# EAGLE design av_unit_fan_ctrl (EAGLE 6.4)
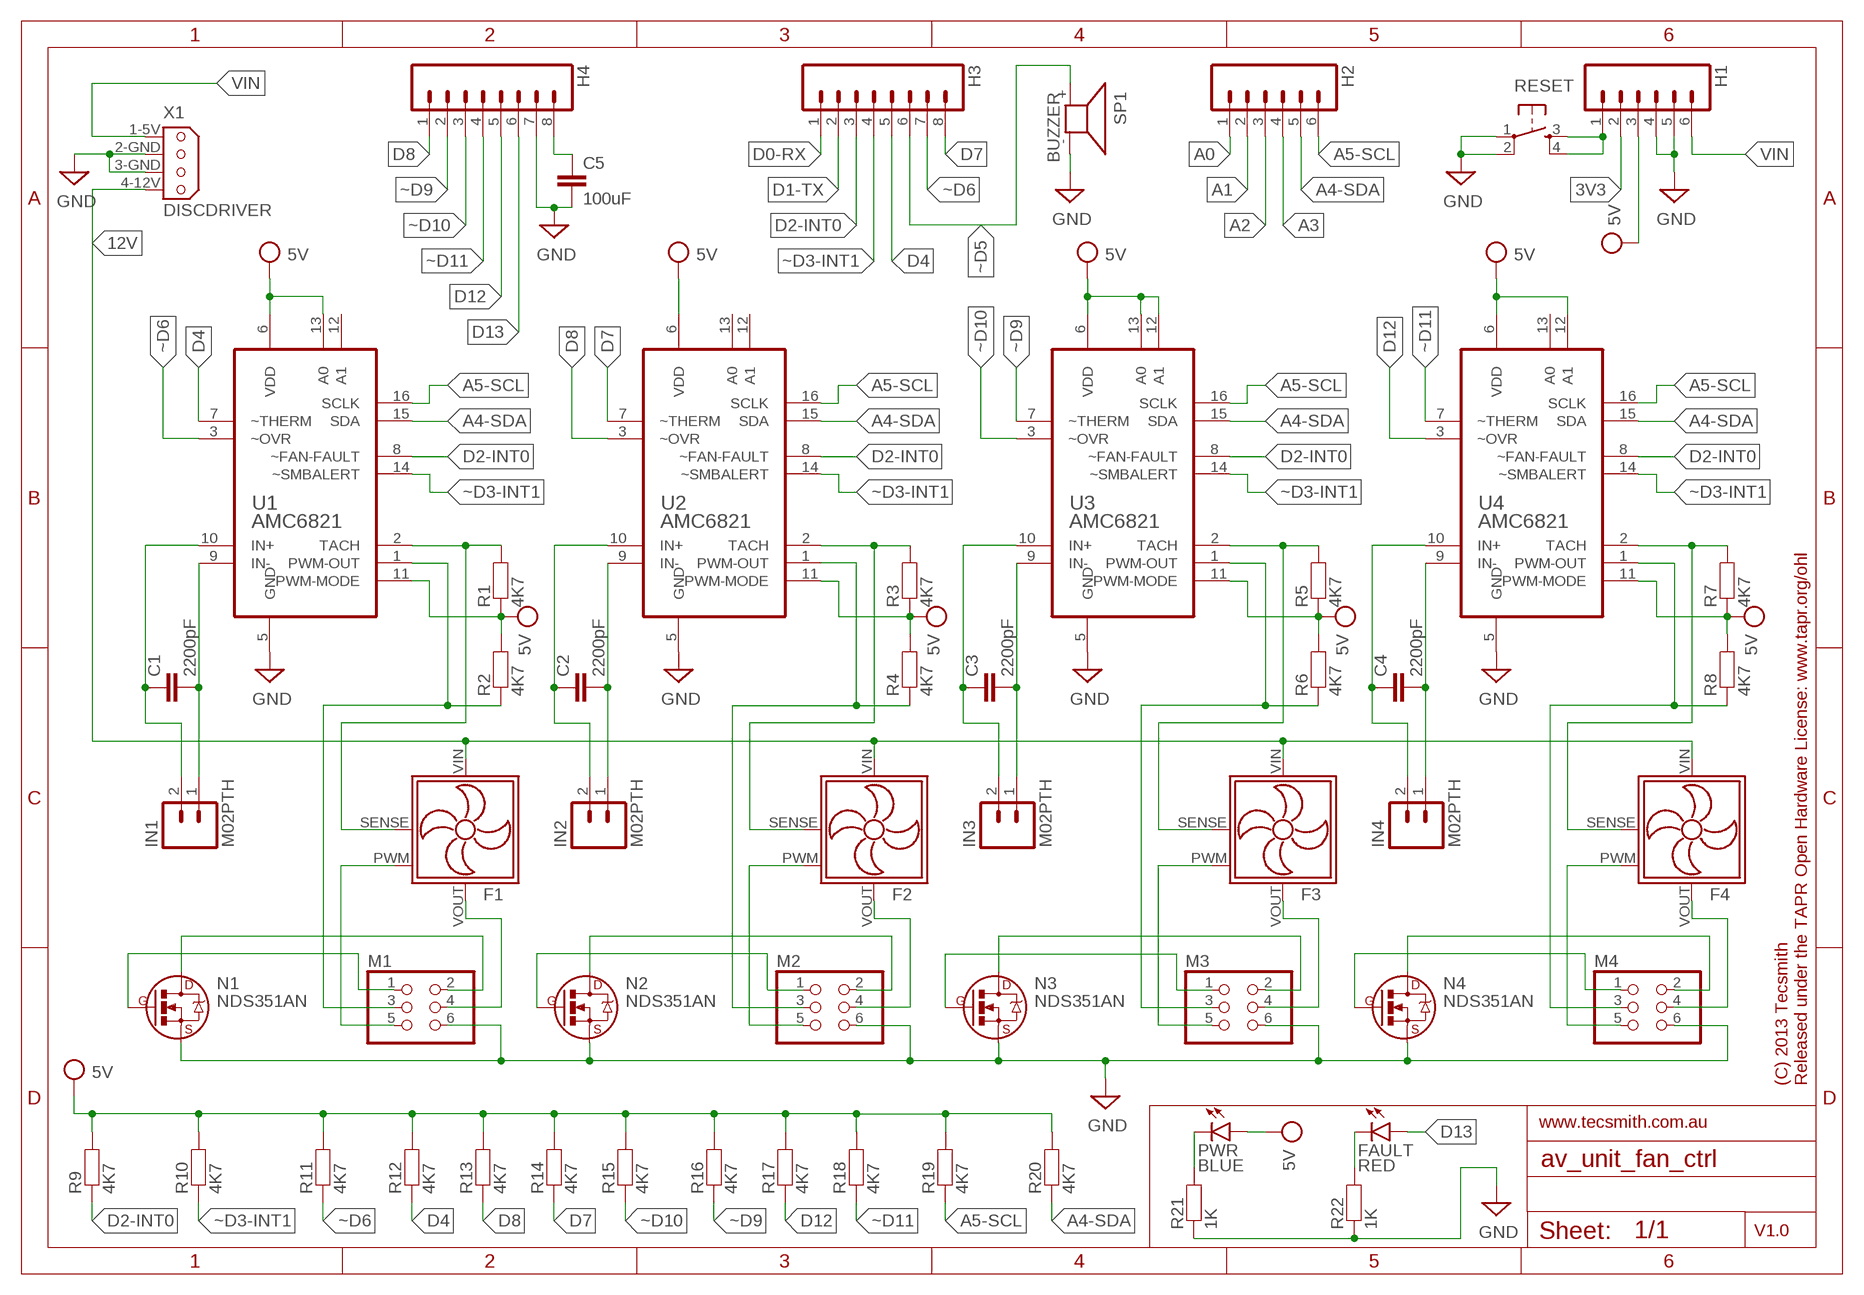
[diagram p0: schematic, sheet 1]

## Parts
C1  2200pF  CAP0603  [0603]
C2  2200pF  CAP0603  [0603]
C3  2200pF  CAP0603  [0603]
C4  2200pF  CAP0603  [0603]
C5  100uF  CAP0603  [0603]
F1  FAN_4-WIREINTEL  [47053-1000]
F2  FAN_4-WIREINTEL  [47053-1000]
F3  FAN_4-WIREINTEL  [47053-1000]
F4  FAN_4-WIREINTEL  [47053-1000]
FAULT  RED  LED0603  [LED-0603]
H1  M06SIP  [1X06]
H2  M06SIP  [1X06]
H3  M08  [1X08]
H4  M08  [1X08]
IN1  M02PTH  [1X02]
IN2  M02PTH  [1X02]
IN3  M02PTH  [1X02]
IN4  M02PTH  [1X02]
M1  PINHD-2X3  [2X03]
M2  PINHD-2X3  [2X03]
M3  PINHD-2X3  [2X03]
M4  PINHD-2X3  [2X03]
N1  NDS351AN  NMOSFETGSD  [SOT23]
N2  NDS351AN  NMOSFETGSD  [SOT23]
N3  NDS351AN  NMOSFETGSD  [SOT23]
N4  NDS351AN  NMOSFETGSD  [SOT23]
PWR  BLUE  LED0603  [LED-0603]
R1  4K7  RESISTOR0603  [0603]
R2  4K7  RESISTOR0603  [0603]
R3  4K7  RESISTOR0603  [0603]
R4  4K7  RESISTOR0603  [0603]
R5  4K7  RESISTOR0603  [0603]
R6  4K7  RESISTOR0603  [0603]
R7  4K7  RESISTOR0603  [0603]
R8  4K7  RESISTOR0603  [0603]
R9  4K7  RESISTOR0603  [0603]
R10  4K7  RESISTOR0603  [0603]
R11  4K7  RESISTOR0603  [0603]
R12  4K7  RESISTOR0603  [0603]
R13  4K7  RESISTOR0603  [0603]
R14  4K7  RESISTOR0603  [0603]
R15  4K7  RESISTOR0603  [0603]
R16  4K7  RESISTOR0603  [0603]
R17  4K7  RESISTOR0603  [0603]
R18  4K7  RESISTOR0603  [0603]
R19  4K7  RESISTOR0603  [0603]
R20  4K7  RESISTOR0603  [0603]
R21  1K  RESISTOR0603  [0603]
R22  1K  RESISTOR0603  [0603]
RESET  TAC_SWITCHPTH  [TACTILE-PTH]
SP1  BUZZER  [KSTG951AP]
U1  AMC6821  AMC6821SDBQQSOP  [QSOP-16N]
U2  AMC6821  AMC6821SDBQQSOP  [QSOP-16N]
U3  AMC6821  AMC6821SDBQQSOP  [QSOP-16N]
U4  AMC6821  AMC6821SDBQQSOP  [QSOP-16N]
X1  DISCDRIVER  [9090-4R]

## Nets
3V3: H1.2
5V: H1.3 PWR.A R1.1 R2.2 R3.1 R4.2 R5.1 R6.2 R7.1 R8.2 R9.2 R10.2 R11.2 R12.2 R13.2 R14.2 R15.2 R16.2 R17.2 R18.2 R19.2 R20.2 U1.6(VDD) U1.11(PWM-MODE) U1.13(A0) U2.6(VDD) U2.11(PWM-MODE) U3.6(VDD) U3.11(PWM-MODE) U3.12(A1) U3.13(A0) U4.6(VDD) U4.11(PWM-MODE) U4.12(A1)
12V: F1.VIN(PWR) F2.VIN(PWR) F3.VIN(PWR) F4.VIN(PWR) X1.4-12V
A0: H2.1
A1: H2.2
A2: H2.3
A3: H2.4
A4-SDA: H2.5 R20.1 U1.15(SDA) U2.15(SDA) U3.15(SDA)
A5-SCL: H2.6 R19.1 U1.16(SCLK) U2.16(SCLK) U3.16(SCLK) U4.16(SCLK)
AREF: C5.1 H4.8
D0-RX: H3.1
D1-TX: H3.2
D2-INT0: H3.3 R9.1 U1.8(~FAN-FAULT) U2.8(~FAN-FAULT) U3.8(~FAN-FAULT) U4.8(~FAN-FAULT)
D4: H3.5 R12.1 U1.7(~THERM)
D7: H3.8 R14.1 U2.7(~THERM)
D8: H4.1 R13.1 U2.3(~OVR)
D12: H4.5 R17.1 U4.3(~OVR)
D13: FAULT.A H4.6
GND: C5.2 H1.4 H1.5 H4.7 M1.6 M2.6 M3.6 M4.6 N1.2(S) N2.2(S) N3.2(S) N4.2(S) R21.1 R22.1 RESET.1 RESET.2 SP1.- U1.5(GND) U2.5(GND) U3.5(GND) U4.5(GND) X1.2-GND X1.3-GND
N$1: F1.VOUT(GND) M1.4
N$2: F2.VOUT(GND) M2.4
N$3: F1.PWM M1.5
N$4: F4.VOUT(GND) M4.4
N$5: M1.2 N1.3(D)
N$6: M2.2 N2.3(D)
N$7: M3.2 N3.3(D)
N$8: M4.2 N4.3(D)
N$11: FAULT.C R22.2
N$12: PWR.C R21.2
N$13: M1.1 N1.1(G)
N$14: M4.3 R8.1 U4.1(PWM-OUT)
N$15: M3.1 N3.1(G)
N$17: F4.SENSE R7.2 U4.2(TACH)
N$21: M3.3 R6.1 U3.1(PWM-OUT)
N$22: F3.SENSE R5.2 U3.2(TACH)
N$23: C1.1 IN1.2 U1.10(IN+)
N$24: M2.3 R4.1 U2.1(PWM-OUT)
N$25: F2.SENSE R3.2 U2.2(TACH)
N$26: M2.1 N2.1(G)
N$27: H1.1 RESET.3 RESET.4
N$28: F4.PWM M4.5
N$29: F3.PWM M3.5
N$30: M4.1 N4.1(G)
N$31: M1.3 R2.1 U1.1(PWM-OUT)
N$33: F1.SENSE R1.2 U1.2(TACH)
N$34: F3.VOUT(GND) M3.4
N$35: F2.PWM M2.5
N$45: C4.1 IN4.2 U4.10(IN+)
N$54: C3.1 IN3.2 U3.10(IN+)
N$56: C2.1 IN2.2 U2.10(IN+)
N$57: C1.2 IN1.1 U1.9(IN-)
N$58: C2.2 IN2.1 U2.9(IN-)
N$59: C3.2 IN3.1 U3.9(IN-)
N$60: C4.2 IN4.1 U4.9(IN-)
VIN: H1.6 X1.1-5V
~D3-INT1: H3.4 R10.1 U1.14(~SMBALERT) U2.14(~SMBALERT) U3.14(~SMBALERT) U4.14(~SMBALERT)
~D5: H3.6 SP1.+
~D6: H3.7 R11.1 U1.3(~OVR)
~D9: H4.2 R16.1 U3.7(~THERM)
~D10: H4.3 R15.1 U3.3(~OVR)
~D11: H4.4 R18.1 U4.7(~THERM)
Unconnected: U1.12(A1) U2.12(A1) U2.13(A0) U4.13(A0) U4.15(SDA)

## Notes on the sheet
- (C) 2013 Tecsmith | Released under the TAPR Open Hardware License: www.tapr.org/ohl
- www.tecsmith.com.au
- V1.0

## Library data of the parts
C1-C5 = arduino:CAP: Capacitor Standard 0603 ceramic capacitor, and 0.1" leaded capacitor.
F1-F4 = fans:FAN_4-WIRE: INTEL SPEC HEADER Source: http://www.molex.com/pdm_docs/sd/026604100_sd.pdf
FAULT PWR = arduino:LED: LEDs Standard schematic elements and footprints for 5mm, 3mm, 1206, and 0603 sized LEDs. 5mm - Spark Fun Electronics SKU : COM-00529 (and others)
H1 H2 = arduino:M06: Header 6 Standard 6-pin 0.1" header. Use with straight break away headers (SKU : PRT-00116), right angle break away headers (PRT-00553), swiss pins (PRT-00743), machine pins (PRT-00117), and female headers (PRT-00115). Molex polarized connector foot print use with SKU : PRT-08094 with associated crimp pins and housings. NOTES ON THE VARIANTS LOCK and LOCK_LONGPADS... This footprint was designed to help hold the alignment of a through-hole component (i.e. 6-pin header) while soldering it into place. You may notice that each hole has been shifted either up or down by 0.005 of an inch from it's more standard position (which is a perfectly straight line). This slight alteration caused the pins (the squares in the middle) to touch the edges of the holes. Because they are alternating, it causes a "brace" to hold the component in place. 0.005 has proven to be the perfect amount of "off-center" position when using our standard breakaway headers. Although looks a little odd when you look at the bare footprint, once you have a header in there, the alteration is very hard to notice. Also, if you push a header all the way into place, it is covered up entirely on the bottom side. This idea of altering the position of holes to aid alignment will be further integrated into the Sparkfun Library for other footprints. It can help hold any component with 3 or more connection pins.
H3 H4 = arduino:M08: Header 8 Standard 8-pin 0.1" header. Use with straight break away headers (SKU : PRT-00116), right angle break away headers (PRT-00553), swiss pins (PRT-00743), machine pins (PRT-00117), and female headers (PRT-00115).
IN1-IN4 = arduino:M02: Header 2
M1-M4 = arduino:PINHD-2X3: PIN HEADER
N1-N4 = arduino:NMOSFET: N-Channel MOSFET
R1-R22 = arduino:RESISTOR: Resistor Basic schematic elements and footprints for 0603, 1206, and PTH 1/10th watt (small) resistors.
RESET = arduino:TAC_SWITCH: Momentary Switch Button commonly used for reset or general input. Spark Fun Electronics SKU : COM-00097
SP1 = arduino:BUZZER: SPEAKER Source: Schukat; OC_FARNELL: unknown; OC_NEWARK: unknown
U1-U4 = ti-fans:AMC6821SDBQ: Intelligent Temperature Monitor and PWM Fan Controller; MPN: AMC6821SDBQ; OC_FARNELL: 1754744; OC_NEWARK: 52M3024; PACKAGE: QSOP-16; SUPPLIER: TEXAS INSTRUMENTS
X1 = fans:DISCDRIVE: Disk Drive Power four position Source: Thomas & Betts Electronic Interconnects Eiropean Edition 1998; OC_FARNELL: unknown; OC_NEWARK: unknown

## Net classes
2 gnd: width 0.254 mm, drill 0.61 mm, clearance 0.254 mm

## Board
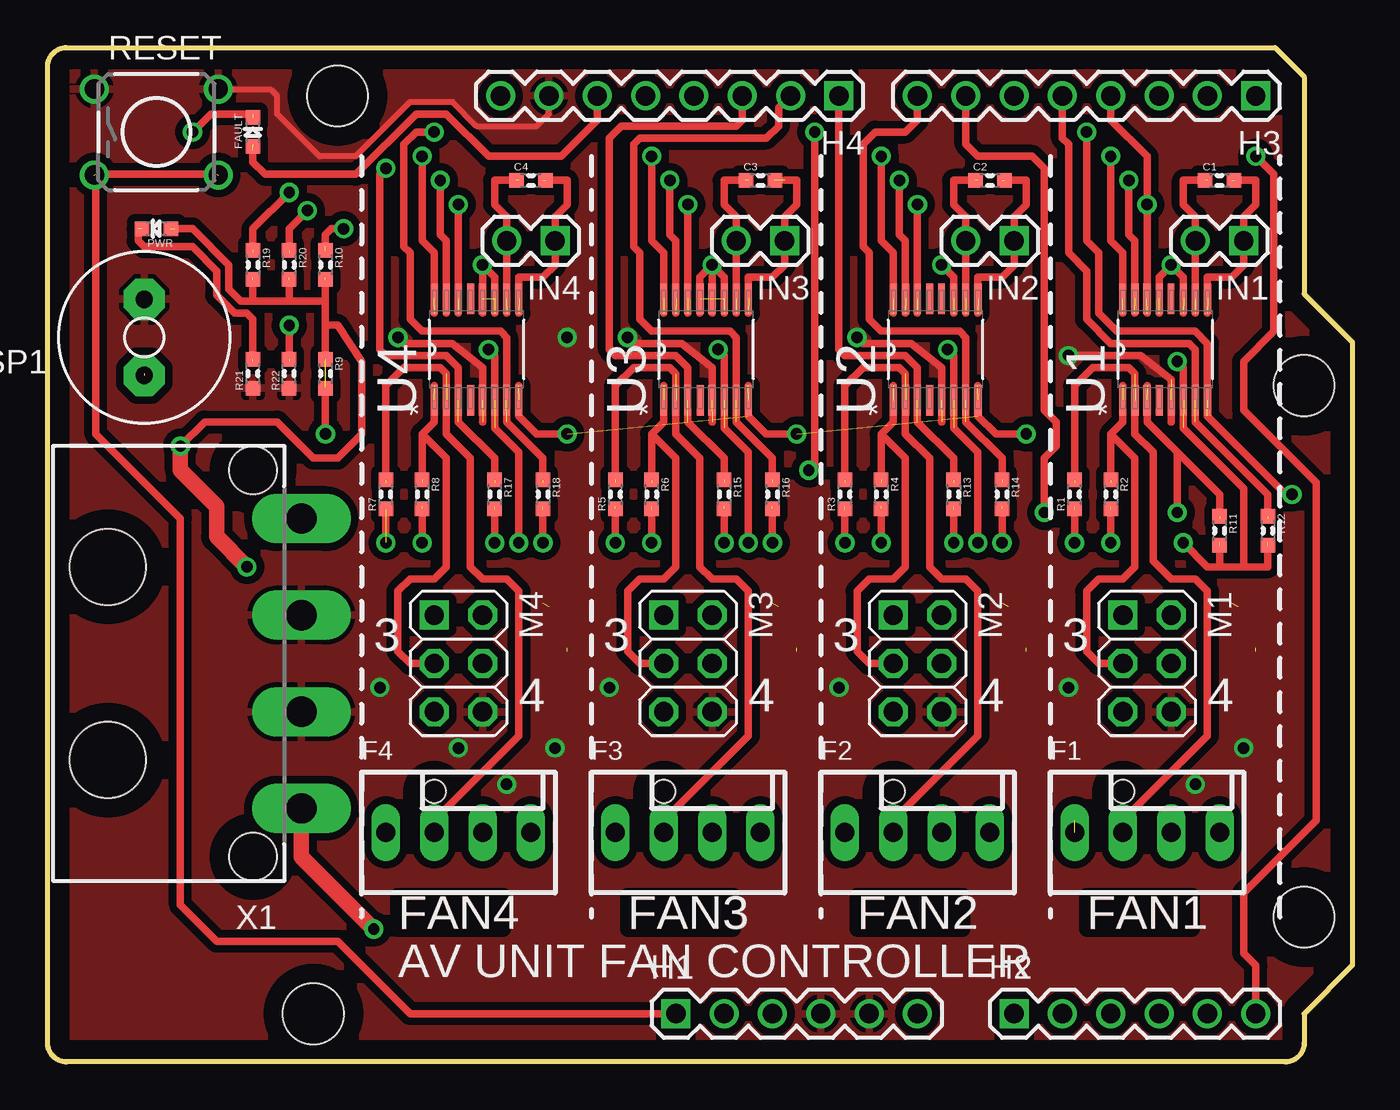
[diagram p1: board, top side]
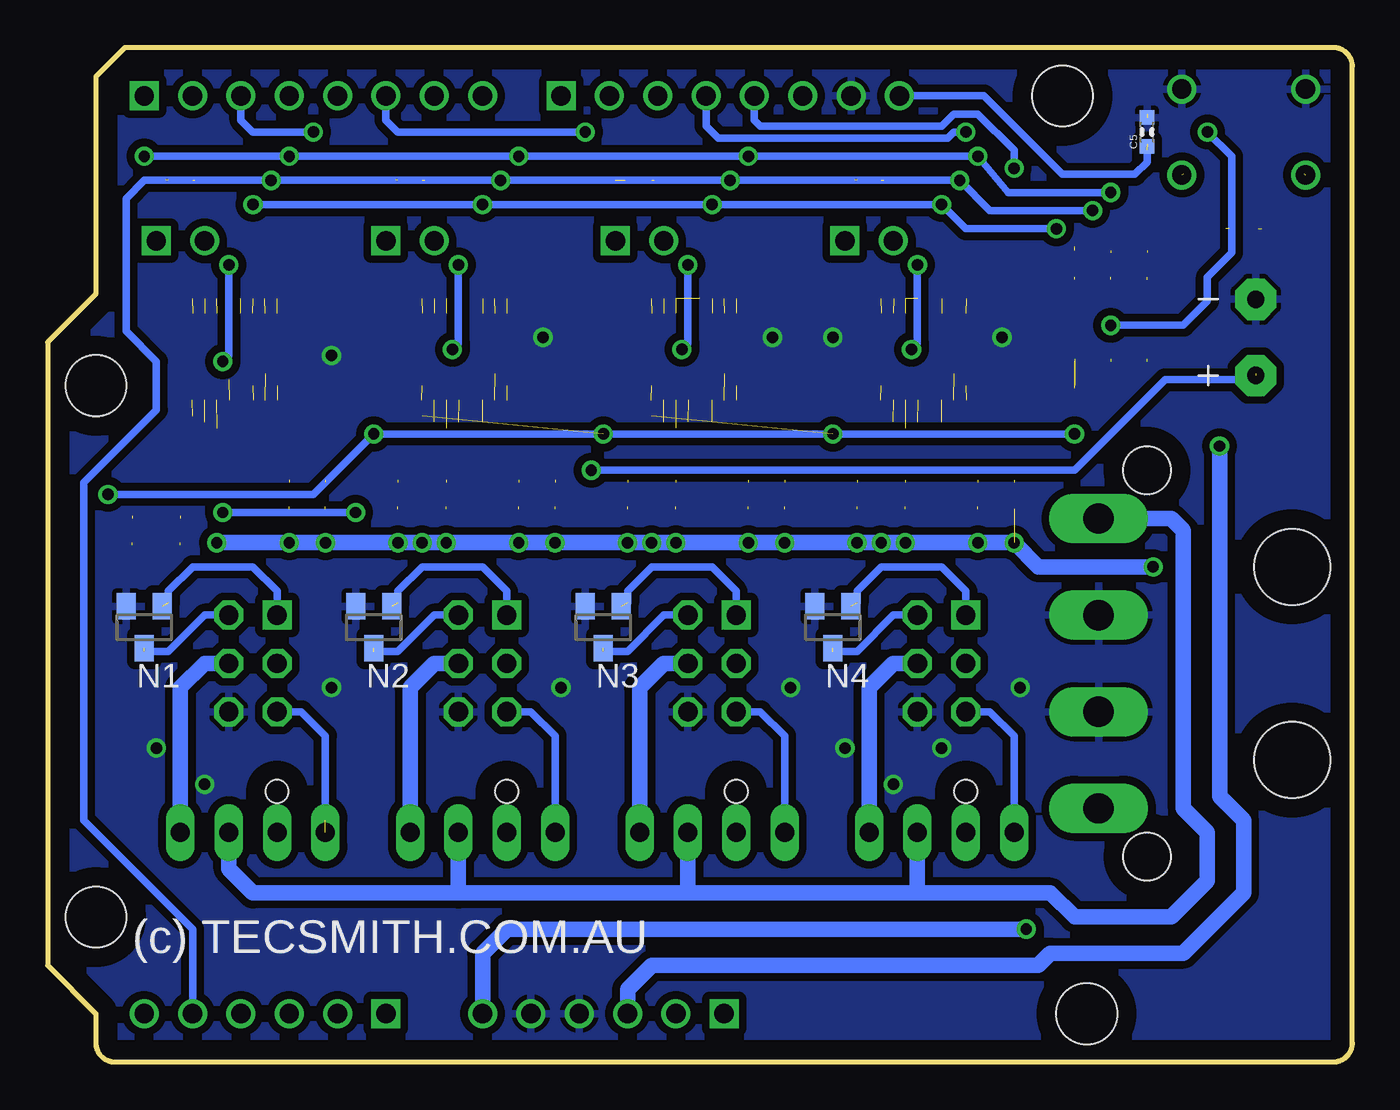
[diagram p2: board, bottom side, seen from below]

Size 68.58 x 53.34 mm. Coordinates in mm from the lower left corner, seen from the top.
Outline: 64.52,53.34 66.04,51.82 66.04,40.39 68.58,37.85 68.58,5.08 66.04,2.54 66.04,1 arc-90 65.04,0 1,0 arc-90 0,1 0,52.34 arc-90 1,53.34 64.52,53.34
Copper layers (1*16): Top 0.035mm / dielectric 1.5mm / Bottom 0.035mm
Design rules "default": minimum track width 10mil, minimum drill 24mil, track to track 8mil, track to pad 8mil, pad to pad 8mil, via to via 8mil, smd to smd 8mil, copper to edge 40mil, drill to drill 8mil, minimum pad ring 10mil, minimum via ring 8mil, stop-mask expansion 4mil, vias tented up to drill 0mil, thermal gap 10mil
Holes 3.2 mm at 66.04,35.56 66.04,7.62 15.24,50.8 13.97,2.54

### Footprints (pad centres in the part's own frame; a part is rotated, then mirrored left to right if it is on the bottom)
0603 = smd 0.762 x 0.762: 1 -0.762,0; 2 0.762,0
47053-1000 = drill 1 long: PWM -3.81,0; SENSE -1.27,0; VIN 1.27,0; VOUT 3.81,0 | hole 1.2: -1.27,2.159
LED-0603 = smd 0.762 x 0.762: A -0.762,0; C 0.762,0
1X06 = drill 1.016 square: 1 0,0 | drill 1.016: 2 2.54,0; 3 5.08,0; 4 7.62,0; 5 10.16,0; 6 12.7,0
1X08 = drill 1.016 square: 1 0,0 | drill 1.016: 2 2.54,0; 3 5.08,0; 4 7.62,0; 5 10.16,0; 6 12.7,0; 7 15.24,0; 8 17.78,0
1X02 = drill 1.016 square: 1 0,0 | drill 1.016: 2 2.54,0
2X03 = drill 1.016 square: 1 -2.54,-1.27 | drill 1.016 octagon: 2 -2.54,1.27; 3 0,-1.27; 4 0,1.27; 5 2.54,-1.27; 6 2.54,1.27
SOT23 = smd 1 x 1.4: 1 -0.95,-1.1; 2 0.95,-1.1; 3 0,1.1
TACTILE-PTH = drill 1.016: 1 -3.251,2.261; 2 3.251,2.261; 3 -3.251,-2.261; 4 3.251,-2.261
KSTG951AP = drill 0.914 pad 2.159 octagon: + 0,2; - 0,-2
QSOP-16N = smd 1.6 x 0.356: 1 -2.667,2.235; 2 -2.667,1.575; 3 -2.667,0.965; 4 -2.667,0.305; 5 -2.667,-0.305; 6 -2.667,-0.965; 7 -2.667,-1.575; 8 -2.667,-2.235; 9 2.667,-2.235; 10 2.667,-1.575; 11 2.667,-0.965; 12 2.667,-0.305; 13 2.667,0.305; 14 2.667,0.965; 15 2.667,1.575; 16 2.667,2.235
9090-4R = drill 1.6 pad 2.6 long: 1-5V -7.62,-6.35; 2-GND -2.54,-6.35; 3-GND 2.54,-6.35; 4-12V 7.62,-6.35 | hole 4: -5.08,3.81; 5.08,3.81 | hole 2.5: -10.16,-3.81; 10.16,-3.81

### Placement (x,y rotation side)
C1  61.59,46.35 0 top
C2  49.53,46.35 0 top
C3  37.47,46.35 0 top
C4  25.4,46.35 0 top
C5  10.79,48.9 90 bottom
F1  57.78,12.06 0 top
F2  45.72,12.06 0 top
F3  33.66,12.06 0 top
F4  21.59,12.06 0 top
FAULT  10.79,48.9 90 top
H1  33.02,2.54 0 top
H2  50.8,2.54 0 top
H3  63.5,50.8 180 top
H4  41.59,50.8 180 top
IN1  62.87,43.18 180 top
IN2  50.8,43.18 180 top
IN3  38.73,43.18 180 top
IN4  26.67,43.18 180 top
M1  57.78,20.95 270 top
M2  45.72,20.95 270 top
M3  33.66,20.95 270 top
M4  21.59,20.95 270 top
N1  63.5,22.86 180 bottom
N2  51.44,22.86 180 bottom
N3  39.37,22.86 180 bottom
N4  27.3,22.86 180 bottom
PWR  5.71,43.81 180 top
R1  53.98,29.84 90 top
R2  55.88,29.84 270 top
R3  41.91,29.84 90 top
R4  43.81,29.84 270 top
R5  29.84,29.84 90 top
R6  31.75,29.84 270 top
R7  17.78,29.84 90 top
R8  19.68,29.84 270 top
R9  14.61,36.2 270 top
R10  14.61,41.91 270 top
R11  61.59,27.94 270 top
R12  64.14,27.94 270 top
R13  47.62,29.84 270 top
R14  50.16,29.84 270 top
R15  35.56,29.84 270 top
R16  38.1,29.84 270 top
R17  23.5,29.84 270 top
R18  26.04,29.84 270 top
R19  10.79,41.91 270 top
R20  12.7,41.91 270 top
R21  10.79,36.2 90 top
R22  12.7,36.2 90 top
RESET  5.71,48.9 0 top
SP1  5.08,38.1 180 top
U1  58.74,37.47 90 top
U2  46.67,37.47 90 top
U3  34.61,37.47 90 top
U4  22.54,37.47 90 top
X1  6.99,20.95 90 top

### Tracks (layer width: path | path; a pad name or v marks a point on that pad's centre or on a via)
5V  (via drill 0.6)  (33 unrouted)
  Top 0.406: 19.68,29.21 v19.68,27.3 | 29.84,29.21 v29.84,27.3 | 31.75,29.21 v31.75,27.3 | 41.91,29.21 v41.91,27.3 | 43.81,29.21 v43.81,27.3 | 53.98,29.21 v53.98,27.3 | 55.88,29.21 v55.88,27.3 | 10.79,40.01 12.7,40.01 | 12.7,40.01 14.61,40.01 | 14.61,40.01 14.61,41.27 | 12.7,41.27 12.7,40.01 | 10.79,41.27 10.79,40.01 | 23.5,29.21 v23.5,27.3 | 26.04,29.21 v26.04,27.3 | 35.56,29.21 v35.56,27.3 | 38.1,29.21 v38.1,27.3 | 47.62,29.21 v47.62,27.3 | 50.16,29.21 v50.16,27.3 | v24.77,27.3 24.77,32.07 23.5,33.34 23.5,37.15 v23.18,37.47 | v36.83,27.3 36.83,32.07 35.56,33.34 35.56,37.15 v35.24,37.47 | v48.9,27.3 48.9,32.07 47.62,33.34 47.62,37.15 v47.31,37.47 | 14.61,40.01 14.61,38.73 | 14.61,38.73 14.61,36.83 | v59.37,36.83 59.69,36.51 59.69,33.34 62.87,30.16 62.87,26.04 | 58.42,39.37 58.42,41.27 v59.05,41.91 59.69,41.27 59.69,39.37 | v59.69,27.3 60.96,26.04 61.59,26.04 | 61.59,26.04 62.87,26.04 | 62.87,26.04 64.14,26.04 64.14,27.3 | 61.59,26.04 61.59,27.3 | 47.62,39.37 47.62,41.27 v46.99,41.91 | v34.92,41.91 34.92,39.37 | 35.56,39.37 35.56,41.27 v34.92,41.91 | v34.92,41.91 34.29,41.27 34.29,39.37 | 22.86,39.37 v22.86,41.91 23.5,41.27 23.5,39.37 | v6.99,32.38 8.26,33.66 12.06,33.66 13.97,31.75 15.24,31.75 16.51,33.02 16.51,36.83 15.24,38.73 14.61,38.73 | 6.67,43.81 7.62,43.81 9.53,41.91 9.53,40.64 10.16,40.01 10.79,40.01
  Top 0.813: v10.48,26.04 8.89,27.62 8.89,29.21 6.99,31.11 v6.99,32.38
  Bottom 0.406: v59.05,41.91 59.05,37.15 v59.37,36.83 | v47.31,37.47 46.99,37.78 v46.99,41.91 | v35.24,37.47 34.92,37.78 v34.92,41.91 | v23.18,37.47 22.86,37.78 v22.86,41.91
  Bottom 0.813: H1.3 38.1,3.81 36.83,5.08 16.51,5.08 15.88,5.71 8.89,5.71 5.71,8.89 5.71,12.7 6.99,13.97 v6.99,32.38 | v10.48,26.04 16.51,26.04 17.78,27.3 v19.68,27.3 v23.5,27.3 v24.77,27.3 v26.04,27.3 v29.84,27.3 v31.75,27.3 v35.56,27.3 v36.83,27.3 v38.1,27.3 v41.91,27.3 v43.81,27.3 v47.62,27.3 v48.9,27.3 v50.16,27.3 v53.98,27.3 v55.88,27.3 v59.69,27.3
12V
  Bottom 0.813: 22.86,8.89 34.92,8.89 | 34.92,8.89 46.99,8.89 | 46.99,8.89 57.78,8.89 59.05,10.16 F1.VIN | F4.VIN 22.86,8.89 | F3.VIN 34.92,8.89 | F2.VIN 46.99,8.89 | X1.4-12V 9.53,28.57 8.89,27.94 8.89,13.34 7.62,12.06 7.62,9.53 9.53,7.62 14.61,7.62 15.88,8.89 22.86,8.89
A4-SDA  (via drill 0.6)  (4 unrouted)
  Top 0.406: 20.95,39.37 20.95,43.18 20.64,43.5 v20.64,46.35 | 33.02,39.37 33.02,43.18 32.7,43.5 v32.7,46.35 | 45.09,39.37 45.09,43.18 44.77,43.5 v44.77,46.35 | 57.15,39.37 57.15,43.18 56.83,43.5 v56.83,46.35 | 12.7,42.55 12.7,43.81 v13.65,44.77
  Bottom 0.406: H2.5 60.96,6.99 66.67,12.7 66.67,30.48 62.87,34.29 62.87,36.83 64.45,38.42 64.45,45.4 63.5,46.35 v56.83,46.35 v44.77,46.35 v32.7,46.35 v20.64,46.35 19.05,44.77 v13.65,44.77
A5-SCL  (via drill 0.6)  (5 unrouted)
  Top 0.406: H2.6 63.5,5.08 62.87,5.71 62.87,8.89 66.67,12.7 66.67,30.48 62.87,34.29 62.87,36.83 64.45,38.42 64.45,46.67 v63.5,47.62 | v19.68,47.62 19.68,43.18 20.32,42.55 20.32,39.37 | v31.75,47.62 31.75,43.18 32.38,42.55 32.38,39.37 | v43.81,47.62 43.81,43.18 44.45,42.55 44.45,39.37 | v55.88,47.62 55.88,43.18 56.52,42.55 56.52,39.37 | 10.79,42.55 10.79,43.81 v12.7,45.72
  Bottom 0.406: v63.5,47.62 v55.88,47.62 v43.81,47.62 v31.75,47.62 v19.68,47.62 18.1,45.72 v12.7,45.72
AREF  (1 unrouted)
  Bottom 0.406: H4.8 19.37,50.8 15.24,46.67 11.43,46.67 10.79,47.31 10.79,48.26
D2-INT0  (via drill 0.6)  (7 unrouted)
  Top 0.406: 14.61,35.56 v14.61,33.02 | 48.9,35.56 48.9,33.97 49.85,33.02 v51.44,33.02 | v65.41,29.84 65.09,29.84 60.96,33.97 60.96,37.78 60.33,38.42 56.2,38.42 55.24,39.37 55.24,42.55 54.61,43.18 v54.61,48.9 | 36.83,35.56 36.83,33.97 37.78,33.02 v39.37,33.02 | 24.77,35.56 24.77,33.97 25.72,33.02 v27.3,33.02
  Bottom 0.406: v54.61,48.9 57.78,48.9 58.42,49.53 H3.3 | v14.61,33.02 v51.44,33.02 54.61,29.84 v65.41,29.84
D4  (2 unrouted)
  Top 0.406: H3.5 53.34,48.58 53.66,48.26 53.66,42.55 54.61,41.59 54.61,39.05 55.88,37.78 60.01,37.78 60.33,37.47 60.33,33.66 64.14,29.84 64.14,28.57
D7  (2 unrouted)
  Top 0.406: 50.16,30.48 50.16,31.75 48.26,33.66 48.26,38.1 47.94,38.42 43.81,38.42 43.18,39.05 43.18,42.55 42.86,42.86 42.86,48.26 43.5,48.9 45.09,48.9 45.72,49.53 H3.8
D8  (2 unrouted)
  Top 0.406: 47.62,30.48 47.62,31.75 45.72,33.66 45.72,36.51 45.09,37.15 41.91,37.15 41.59,37.47 H4.1
D12  (via drill 0.6)  (2 unrouted)
  Top 0.406: 23.5,30.48 23.5,31.75 21.59,33.66 21.59,36.51 20.95,37.15 17.78,37.15 17.46,37.47 17.46,46.67 v17.78,46.99
  Bottom 0.406: H4.5 31.43,49.53 31.11,49.21 21.59,49.21 20.95,49.85 19.68,49.85 17.78,47.94 v17.78,46.99
D13  (1 unrouted)
  Top 0.406: H4.6 28.89,49.53 26.99,47.62 23.18,47.62 20.95,49.85 19.37,49.85 16.19,46.67 11.43,46.67 10.79,47.31 10.79,47.94
GND  (via drill 0.6)  (4 unrouted)
  Top 0.305: H4.7 26.35,49.85 25.72,49.21 22.54,49.21 21.27,50.48 19.05,50.48 16.19,47.62 14.29,47.62 12.06,49.85 12.06,50.8 11.75,51.12 8.89,51.12
  Top 0.406: v53.66,37.15 57.47,37.15 59.05,35.88 59.05,33.66 | 46.99,33.66 46.99,36.51 45.4,37.78 42.86,37.78 v42.55,38.1 | 34.92,33.66 34.92,36.51 33.34,37.78 30.8,37.78 v30.48,38.1 | 22.86,33.66 22.86,36.51 21.27,37.78 18.73,37.78 v18.41,38.1
  other vias: 17.46,19.68 29.53,19.68 41.59,19.68 53.66,19.68 21.59,16.51 24.13,14.61 26.67,16.51 62.87,16.51 60.33,14.61 27.3,38.1
  pour Top (isolate 0.406): 1.27,53.34 63.5,53.34 arc-90 66.04,50.8 66.04,40.01 68.58,37.47 68.58,5.71 66.04,3.17 66.04,1.27 arc-90 64.77,0 1.27,0 arc-90 0,1.27 0,52.07 arc-90
  pour Bottom (isolate 0.406): 1.27,53.34 63.5,53.34 arc-90 66.04,50.8 66.04,40.01 68.58,37.47 68.58,5.71 66.04,3.17 66.04,1.27 arc-90 64.77,0 1.27,0 arc-90 0,1.27 0,52.07 arc-90
N$1
  Bottom 0.813: M1.4 60.33,20.95 61.59,19.68 F1.VOUT
N$2
  Bottom 0.813: M2.4 48.26,20.95 49.53,19.68 F2.VOUT
N$3  (1 unrouted)
  Bottom 0.406: 53.98,12.7 53.98,17.14 55.24,18.41 M1.5
N$4
  Bottom 0.813: F4.VOUT 25.4,19.68 24.13,20.95 M4.4
N$5  (1 unrouted)
  Bottom 0.406: M1.2 60.33,23.5 62.23,21.59 63.5,21.59
N$6  (1 unrouted)
  Bottom 0.406: M2.2 48.26,23.5 50.16,21.59 51.44,21.59
N$7  (1 unrouted)
  Bottom 0.406: M3.2 36.2,23.5 38.1,21.59 39.37,21.59
N$8  (1 unrouted)
  Bottom 0.406: M4.2 24.13,23.5 26.04,21.59 27.3,21.59
N$11  (via drill 0.6)  (2 unrouted)
  Top 0.406: v12.7,38.73 12.7,36.83 | 10.79,49.85 8.57,49.85 v7.62,48.9
  Bottom 0.406: v12.7,38.73 8.89,38.73 7.62,40.01 7.62,41.27 6.35,42.55 6.35,46.99 6.35,47.62 v7.62,48.9
N$12  (2 unrouted)
  Top 0.406: 4.76,43.81 4.76,43.18 5.08,42.86 7.62,42.86 8.89,41.59 8.89,40.32 9.84,39.37 10.48,39.37 10.79,39.05 10.79,37.47 10.79,37.15 10.79,36.83
N$13  (1 unrouted)
  Bottom 0.406: M1.1 56.52,24.77 57.78,26.04 60.96,26.04 62.23,24.77 62.23,24.13
N$14  (2 unrouted)
  Top 0.406: 20.32,35.56 20.32,33.66 19.68,33.02 | 19.68,33.02 19.68,30.48 | 19.68,33.02 20.95,31.75 20.95,26.04 20.32,25.4 19.05,25.4 18.41,24.77 18.41,21.59 19.05,20.95 M4.3
N$15  (1 unrouted)
  Bottom 0.406: M3.1 32.38,24.77 33.66,26.04 36.83,26.04 38.1,24.77 38.1,24.13
N$17  (2 unrouted)
  Top 0.406: 17.78,30.48 17.78,35.56 18.73,36.51 20.64,36.51 20.95,36.2 20.95,33.02 22.23,31.75 22.23,26.04 22.86,25.4 24.13,25.4 24.77,24.77 24.77,17.14 20.32,12.7 F4.SENSE
N$21  (2 unrouted)
  Top 0.406: 32.38,35.56 32.38,33.66 31.75,33.02 | 31.75,33.02 31.75,30.48 | 31.75,33.02 33.02,31.75 33.02,26.04 32.38,25.4 31.11,25.4 30.48,24.77 30.48,21.59 31.11,20.95 M3.3
N$22  (2 unrouted)
  Top 0.406: 29.84,30.48 29.84,35.56 30.8,36.51 32.7,36.51 33.02,36.2 33.02,33.02 34.29,31.75 34.29,26.04 34.92,25.4 36.2,25.4 36.83,24.77 36.83,17.14 32.38,12.7 F3.SENSE
N$23  (2 unrouted)
  Top 0.406: 60.96,46.35 59.69,46.35 59.69,45.09 60.33,44.45 IN1.2 60.33,39.37
N$24  (2 unrouted)
  Top 0.406: 44.45,35.56 44.45,33.66 43.81,33.02 | 43.81,33.02 43.81,30.48 | 43.81,33.02 45.09,31.75 45.09,26.04 44.45,25.4 43.18,25.4 42.55,24.77 42.55,21.59 43.18,20.95 M2.3
N$25  (2 unrouted)
  Top 0.406: 41.91,30.48 41.91,35.56 42.86,36.51 44.77,36.51 45.09,36.2 45.09,33.02 46.35,31.75 46.35,26.04 46.99,25.4 48.26,25.4 48.9,24.77 48.9,17.14 44.45,12.7 F2.SENSE
N$26  (1 unrouted)
  Bottom 0.406: M2.1 44.45,24.77 45.72,26.04 48.9,26.04 50.16,24.77 50.16,24.13
N$27  (2 unrouted)
  Top 0.406: H1.1 19.05,2.54 15.24,6.35 8.89,6.35 6.99,8.26 6.99,28.57 2.54,33.02 2.54,46.67 8.89,46.67
N$28
  Bottom 0.406: F4.PWM 17.78,17.14 19.05,18.41 M4.5
N$29
  Bottom 0.406: F3.PWM 29.84,17.14 31.11,18.41 M3.5
N$30  (1 unrouted)
  Bottom 0.406: M4.1 20.32,24.77 21.59,26.04 24.77,26.04 26.04,24.77 26.04,24.13
N$31  (2 unrouted)
  Top 0.406: 56.52,35.56 56.52,33.66 55.88,33.02 | 55.88,33.02 55.88,30.48 | 55.88,33.02 57.15,31.75 57.15,26.04 56.52,25.4 55.24,25.4 54.61,24.77 54.61,21.59 55.24,20.95 M1.3
N$32  (via drill 0.6)
  Top 0.406: 17.78,29.21 v17.78,27.3
N$33  (2 unrouted)
  Top 0.406: 53.98,30.48 53.98,35.56 54.93,36.51 56.83,36.51 57.15,36.2 57.15,33.02 58.1,32.07 58.1,26.35 59.05,25.4 60.33,25.4 60.96,24.77 60.96,17.14 56.52,12.7 F1.SENSE
N$34
  Bottom 0.813: M3.4 36.2,20.95 37.47,19.68 F3.VOUT
N$35
  Bottom 0.406: F2.PWM 41.91,17.14 43.18,18.41 M2.5
N$45  (2 unrouted)
  Top 0.406: 24.77,46.35 23.5,46.35 23.5,45.09 24.13,44.45 IN4.2 24.13,39.37
N$54  (2 unrouted)
  Top 0.406: 36.83,46.35 35.56,46.35 35.56,45.09 36.2,44.45 IN3.2 36.2,39.37
N$56  (2 unrouted)
  Top 0.406: 48.9,46.35 47.62,46.35 47.62,45.09 48.26,44.45 IN2.2 48.26,39.37
N$57  (2 unrouted)
  Top 0.406: 60.96,39.37 60.96,41.27 62.23,41.27 62.87,41.91 IN1.1 62.87,44.45 63.5,45.09 63.5,46.35 62.23,46.35
N$58  (2 unrouted)
  Top 0.406: 48.9,39.37 48.9,41.27 50.16,41.27 50.8,41.91 IN2.1 50.8,44.45 51.44,45.09 51.44,46.35 50.16,46.35
N$59  (2 unrouted)
  Top 0.406: 36.83,39.37 36.83,41.27 38.1,41.27 38.73,41.91 IN3.1 38.73,44.45 39.37,45.09 39.37,46.35 38.73,46.35
N$60  (2 unrouted)
  Top 0.406: 24.77,39.37 24.77,41.27 26.04,41.27 26.67,41.91 IN4.1 26.67,44.45 27.3,45.09 27.3,46.35 26.04,46.35
VIN  (via drill 0.6)
  Top 0.813: v17.14,6.99 13.34,10.79 X1.1-5V
  Bottom 0.813: v17.14,6.99 44.45,6.99 45.72,5.71 H1.6
~D3-INT1  (via drill 0.6)  (5 unrouted)
  Top 0.406: 21.59,39.37 v21.59,45.09 | 33.66,39.37 v33.66,45.09 | 45.72,39.37 v45.72,45.09 | 57.78,39.37 v57.78,45.09 57.78,47.62 55.88,49.53 H3.4 | v15.56,43.81 14.92,43.81 14.61,43.5 14.61,42.86
  Bottom 0.406: v57.78,45.09 v45.72,45.09 v33.66,45.09 v21.59,45.09 20.32,43.81 v15.56,43.81
~D5  (via drill 0.6)  (1 unrouted)
  Top 0.406: v40.32,48.9 40.32,31.43 v40.01,31.11
  Bottom 0.406: H3.6 50.8,49.53 50.16,48.9 v40.32,48.9 | v40.01,31.11 14.61,31.11 9.84,35.88 5.4,35.88 5.08,36.2
~D6  (via drill 0.6)  (2 unrouted)
  Top 0.406: v52.39,28.89 52.39,31.75 53.02,32.38 53.02,33.66 52.39,34.29 52.39,46.99 51.75,47.62 48.9,47.62 48.26,48.26 H3.7 | 57.78,35.56 57.78,33.66 59.37,32.07 | 59.37,32.07 61.59,29.84 61.59,28.57 | v59.37,28.89 59.37,32.07
  Bottom 0.406: v59.37,28.89 v52.39,28.89
~D9  (2 unrouted)
  Top 0.406: 38.1,30.48 38.1,31.75 36.2,33.66 36.2,38.1 35.88,38.42 31.75,38.42 31.11,39.05 31.11,42.55 30.8,42.86 30.8,48.26 31.11,48.58 37.78,48.58 38.42,49.21 38.42,50.16 H4.2
~D10  (2 unrouted)
  Top 0.406: 35.56,30.48 35.56,31.75 33.66,33.66 33.66,36.51 33.02,37.15 29.84,37.15 29.53,37.47 29.53,48.58 30.16,49.21 36.2,49.21 36.51,49.53 H4.3
~D11  (via drill 0.6)  (2 unrouted)
  Top 0.406: 26.04,30.48 26.04,31.75 24.13,33.66 24.13,38.1 23.81,38.42 19.68,38.42 19.05,39.05 19.05,42.55 18.73,42.86 18.73,48.26 19.37,48.9 v20.32,48.9
  Bottom 0.406: v20.32,48.9 20.95,48.9 21.27,48.58 33.34,48.58 33.97,49.21 H4.4

### Text on the board
Top: FAN4 | FAN3 | FAN2 | FAN1
tPlace: 3 | 3 | 3 | 3 | 4 | 4 | 4 | 4 | FAN4 | FAN3 | FAN2 | FAN1 | AV UNIT FAN CONTROLLER
bPlace: (c) TECSMITH.COM.AU